# Altium schematic sheet Power Circuit.SchDoc
size A4; SheetNumber: 5; SheetTotal: 5
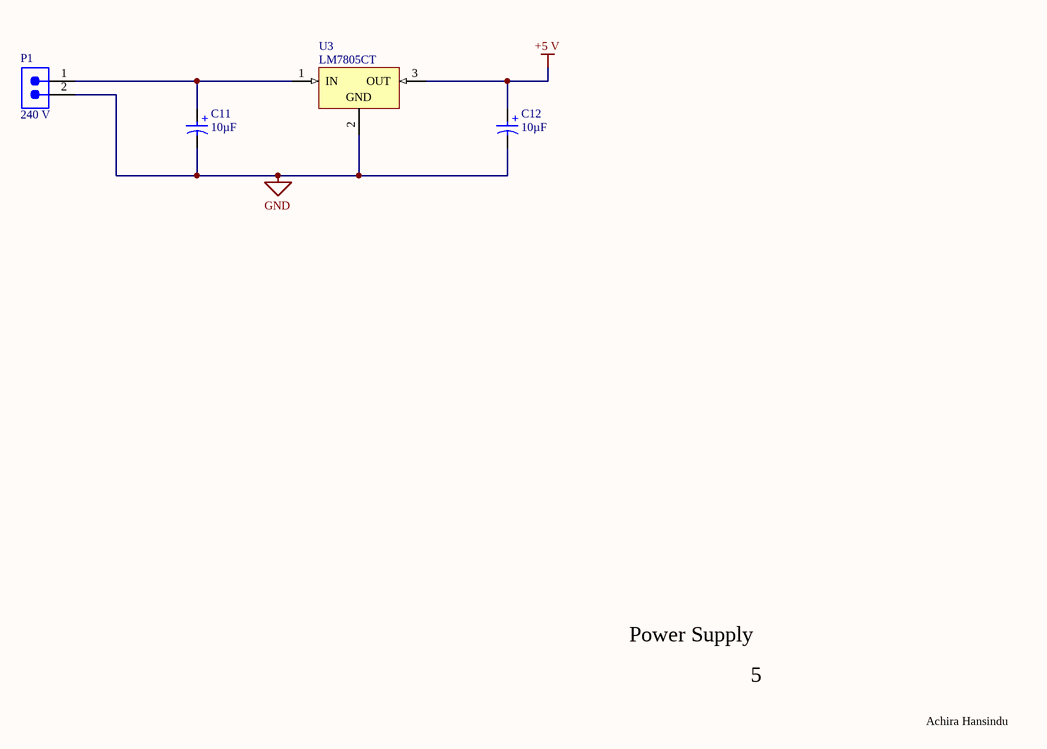
[diagram p0: Power Circuit.SchDoc]

## Parts
C11  Capacitance: 10µF  [WCAP-HTG5_D6.3H8]  (hidden comment: 870575873001)
C12  Capacitance: 10µF  [WCAP-HTG5_D6.3H8]  (hidden comment: 870575873001)
P1  240 V  [691322110002]
U3  LM7805CT  [FAIR-TO-220-3]

## Nets
+5 V: C12.1(P) U3.3(OUT)
GND: C11.2(N) C12.2(N) P1.2 U3.2(GND)
NetC11_1: C11.1(P) P1.1 U3.1(IN)

## Notes on the sheet
- Power Supply
- 5
- Achira Hansindu
- (in symbol CMP-03913-134709123-1) +

## Library data of the parts
C11 C12 = CMP-03913-134709123-1: 870575873001 Cap, 10Uf, 63V, Alu Elec, Hybrid, Rad Rohs Compliant: Yes; Pitch: 2.5mm; Hole Diameter: 900µm; ESR (Equivalent Series Resistance): 100mΩ; Leakage Current: 6.3µA; Ripple Current: 1.06A; NexarPartId: 134709123; Diameter: 6.3mm; Length: 8mm; Voltage Rating: 63V; Max Operating Temperature: 105°C; Min Operating Temperature: -55°C; RoHS: Compliant; Parameter 1: *
P1 = CMP-1502-01791-3: NexarPartId: 18818346; Voltage Rating: 300V; Number of Contacts: 2; Gender: Male; Current: 10A; Number of Levels: 1; Pitch: 3.5052mm; Termination: Solder; Lead Pitch: 3.5mm; Width: 8.1mm; Length: 10.5mm; Number of Positions Per Level: 2; Number of Pins: 2; Max Operating Temperature: 105°C; RoHS: Compliant; Current Rating: 10A; Voltage: 300V; Mount: Through Hole; Color: Green; Min Operating Temperature: -40°C; Height: 7.4mm; Number of Rows: 1; Packaging: Box; Lead Free: Lead Free; REACH SVHC: Unknown; Contact Material: Brass
U3 = CMP-2000-04938-1: Positive Voltage Regulator, 5 V, 1 A, -40 to 125 degC, 3-Pin TO-220, RoHS, Tube; Manufacturer: FairchildSemiconductor; Maximum Input Voltage: 35V; Maximum Quiescent Current: 8mA; Load Regulation: 100mV; Maximum Output Current: 2.2(Typ)A; Output Type: Fixed; Typical Dropout Voltage @ Current: 2@1AV; Rad Hard: No; Output Voltage: 5V; Accuracy: ±4%; Number of Outputs: 1; Category: LinearRegulator; Package Description: 3-Pin Through Hole Device, Body 10 x 4.5 mm, Pitch 2.54 mm; Packaging: Rail/Tube; Mounting: ThroughHole; Polarity: Positive; Manufacturer URL: https://www.fairchildsemi.com/; Line Regulation: 100mV; Datasheet Version: Aug-12; Datasheet URL: https://datasheet.ciiva.com/26904/lm7805ct-26904988.pdf; Package Reference: TO-220; Package URL: https://www.fairchildsemi.com/package-drawings/TO/TO220B03.pdf; Package: 3TO-220AB; Operating Temperature: -40to125degC; Type: Linear